# Altium schematic sheet Kasil_DIOT_x86_board.SchDoc
size 420 x 297 mm; SheetNumber: 1; SheetTotal: 11; ModifiedBy: -; CheckedDate: -; Title2: Title 2; DivGrp: WUT ISE; Designer: G.Kasprowicz
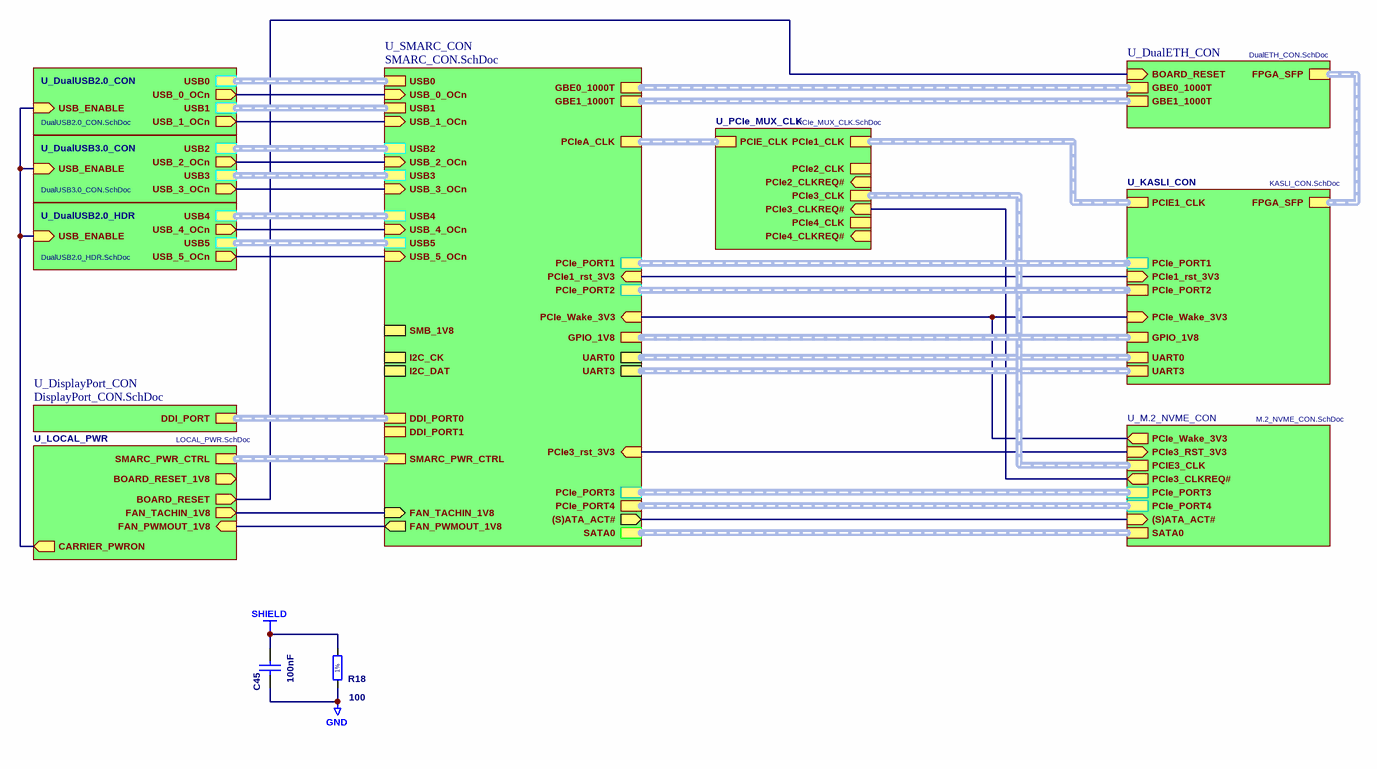
[diagram p0: Kasil_DIOT_x86_board.SchDoc]

## Parts
C45  100nF  [CAPC1005X55N]
R18  100  [RESC1005X40N]

## Sub-sheets
U_DisplayPort_CON = DisplayPort_CON.SchDoc: DDI_PORT (harness DDI_PORT)
U_DualETH_CON = DualETH_CON.SchDoc: GBE0_1000T (harness GBE_copper), GBE1_1000T (harness GBE_copper), FPGA_SFP (harness SFP), BOARD_RESET (in)
U_DualUSB2.0_CON = DualUSB2.0_CON.SchDoc: USB_0_OCn (out), USB1 (harness USB2.0), USB0 (harness USB2.0), USB_1_OCn (out), USB_ENABLE (in)
U_DualUSB2.0_HDR = DualUSB2.0_HDR.SchDoc: USB_5_OCn (out), USB4 (harness USB2.0), USB5 (harness USB2.0), USB_4_OCn (out), USB_ENABLE (in)
U_DualUSB3.0_CON = DualUSB3.0_CON.SchDoc: USB_3_OCn (out), USB3 (harness USB3.0), USB2 (harness USB3.0), USB_2_OCn (out), USB_ENABLE (in)
U_KASLI_CON = KASLI_CON.SchDoc: UART0 (harness UART), UART3 (harness UART), GPIO_1V8 (harness GPIO), PCIE1_CLK (harness CLOCK_DIFF), PCIe_PORT1 (harness PCIe_port), PCIe_PORT2 (harness PCIe_port), FPGA_SFP (harness SFP), PCIe1_rst_3V3 (in), PCIe_Wake_3V3 (in)
U_LOCAL_PWR = LOCAL_PWR.SchDoc: SMARC_PWR_CTRL (harness SMARC_PWR_CTRL), BOARD_RESET (out), BOARD_RESET_1V8 (out), FAN_TACHIN_1V8 (out), FAN_PWMOUT_1V8 (in), CARRIER_PWRON (out)
U_M.2_NVME_CON = M.2_NVME_CON.SchDoc: PCIe3_RST_3V3 (in), PCIe_PORT3 (harness PCIe_port), PCIE3_CLK (harness CLOCK_DIFF), PCIe_PORT4 (harness PCIe_port), PCIe3_CLKREQ# (out), SATA0 (harness SATA), (S)ATA_ACT# (in), PCIe_Wake_3V3 (out)
U_PCIe_MUX_CLK = PCIe_MUX_CLK.SchDoc: PCIE_CLK (harness CLOCK_DIFF), PCIe1_CLK (harness CLOCK_DIFF), PCIe2_CLK (harness CLOCK_DIFF), PCIe3_CLK (harness CLOCK_DIFF), PCIe4_CLK (harness CLOCK_DIFF), PCIe2_CLKREQ# (in), PCIe3_CLKREQ# (in), PCIe4_CLKREQ# (in)
U_SMARC_CON = SMARC_CON.SchDoc: I2C_CK, I2C_DAT, SMB_1V8 (harness SMB), USB_3_OCn (in), USB_0_OCn (in), USB_5_OCn (in), (S)ATA_ACT# (out), USB4 (harness USB2.0), USB5 (harness USB2.0), USB_1_OCn (in), USB_2_OCn (in), USB_4_OCn (in), UART3 (harness UART), UART0 (harness UART), FAN_TACHIN_1V8 (in), FAN_PWMOUT_1V8 (out), PCIe_PORT1 (harness PCIe_port), PCIe_PORT2 (harness PCIe_port), PCIe_PORT3 (harness PCIe_port), USB3 (harness USB3.0), USB2 (harness USB3.0), GBE0_1000T (harness GBE_copper), SATA0 (harness SATA), DDI_PORT0 (harness DDI_PORT), DDI_PORT1 (harness DDI_PORT), SMARC_PWR_CTRL (harness SMARC_PWR_CTRL), GBE1_1000T (harness GBE_copper), PCIeA_CLK (harness CLOCK_DIFF), PCIe_PORT4 (harness PCIe_port), USB0 (harness USB2.0), USB1 (harness USB2.0), PCIe1_rst_3V3 (in), PCIe_Wake_3V3 (in), PCIe3_rst_3V3 (in), GPIO_1V8 (harness GPIO)

## Nets
GND: C45.1 R18.1
SHIELD: C45.2 R18.2
(unnamed): sheet U_SMARC_CON/USB_3_OCn, sheet U_DualUSB3.0_CON/USB_3_OCn
(unnamed): sheet U_SMARC_CON/USB_0_OCn, sheet U_DualUSB2.0_CON/USB_0_OCn
(unnamed): sheet U_SMARC_CON/USB_5_OCn, sheet U_DualUSB2.0_HDR/USB_5_OCn
(unnamed): sheet U_SMARC_CON/(S)ATA_ACT#, sheet U_M.2_NVME_CON/(S)ATA_ACT#
(unnamed): sheet U_SMARC_CON/USB_1_OCn, sheet U_DualUSB2.0_CON/USB_1_OCn
(unnamed): sheet U_SMARC_CON/USB_2_OCn, sheet U_DualUSB3.0_CON/USB_2_OCn
(unnamed): sheet U_SMARC_CON/USB_4_OCn, sheet U_DualUSB2.0_HDR/USB_4_OCn
(unnamed): sheet U_SMARC_CON/FAN_TACHIN_1V8, sheet U_LOCAL_PWR/FAN_TACHIN_1V8
(unnamed): sheet U_SMARC_CON/FAN_PWMOUT_1V8, sheet U_LOCAL_PWR/FAN_PWMOUT_1V8
(unnamed): sheet U_SMARC_CON/PCIe1_rst_3V3, sheet U_KASLI_CON/PCIe1_rst_3V3
(unnamed): sheet U_SMARC_CON/PCIe_Wake_3V3, sheet U_KASLI_CON/PCIe_Wake_3V3, sheet U_M.2_NVME_CON/PCIe_Wake_3V3
(unnamed): sheet U_SMARC_CON/PCIe3_rst_3V3, sheet U_M.2_NVME_CON/PCIe3_RST_3V3
(unnamed): sheet U_DualETH_CON/BOARD_RESET, sheet U_LOCAL_PWR/BOARD_RESET
(unnamed): sheet U_DualUSB2.0_CON/USB_ENABLE, sheet U_DualUSB3.0_CON/USB_ENABLE, sheet U_LOCAL_PWR/CARRIER_PWRON, sheet U_DualUSB2.0_HDR/USB_ENABLE
(unnamed): sheet U_M.2_NVME_CON/PCIe3_CLKREQ#, sheet U_PCIe_MUX_CLK/PCIe3_CLKREQ#

## Buses and harness runs
harness sheet U_DisplayPort_CON/DDI_PORT = sheet U_SMARC_CON/DDI_PORT0
harness sheet U_DualETH_CON/FPGA_SFP = sheet U_KASLI_CON/FPGA_SFP
harness sheet U_DualETH_CON/GBE0_1000T = sheet U_SMARC_CON/GBE0_1000T
harness sheet U_DualETH_CON/GBE1_1000T = sheet U_SMARC_CON/GBE1_1000T
harness sheet U_DualUSB2.0_CON/USB0 = sheet U_SMARC_CON/USB0
harness sheet U_DualUSB2.0_CON/USB1 = sheet U_SMARC_CON/USB1
harness sheet U_DualUSB2.0_HDR/USB4 = sheet U_SMARC_CON/USB4
harness sheet U_DualUSB2.0_HDR/USB5 = sheet U_SMARC_CON/USB5
harness sheet U_DualUSB3.0_CON/USB2 = sheet U_SMARC_CON/USB2
harness sheet U_DualUSB3.0_CON/USB3 = sheet U_SMARC_CON/USB3
harness sheet U_KASLI_CON/GPIO_1V8 = sheet U_SMARC_CON/GPIO_1V8
harness sheet U_KASLI_CON/PCIE1_CLK = sheet U_PCIe_MUX_CLK/PCIe1_CLK
harness sheet U_KASLI_CON/PCIe_PORT1 = sheet U_SMARC_CON/PCIe_PORT1
harness sheet U_KASLI_CON/PCIe_PORT2 = sheet U_SMARC_CON/PCIe_PORT2
harness sheet U_KASLI_CON/UART0 = sheet U_SMARC_CON/UART0
harness sheet U_KASLI_CON/UART3 = sheet U_SMARC_CON/UART3
harness sheet U_LOCAL_PWR/SMARC_PWR_CTRL = sheet U_SMARC_CON/SMARC_PWR_CTRL
harness sheet U_M.2_NVME_CON/PCIE3_CLK = sheet U_PCIe_MUX_CLK/PCIe3_CLK
harness sheet U_M.2_NVME_CON/PCIe_PORT3 = sheet U_SMARC_CON/PCIe_PORT3
harness sheet U_M.2_NVME_CON/PCIe_PORT4 = sheet U_SMARC_CON/PCIe_PORT4
harness sheet U_M.2_NVME_CON/SATA0 = sheet U_SMARC_CON/SATA0
harness sheet U_PCIe_MUX_CLK/PCIE_CLK = sheet U_SMARC_CON/PCIeA_CLK

## Notes on the sheet
- Project/Equipment
- Document
- Designer
- Drawn by
- Check.by
- Copyright WUT ISE 2024.
  This documentation describes Open Hardware and is licensed under the CERN OHL v.2. You may redistribute and modify this documentation under the terms of the CERN OHL v.2. (http://ohwr.org/CERNOHL). This documentation is distributed WITHOUT ANY EXPRESS OR IMPLIED WARRANTY, INCLUDING OF MERCHANTABILITY, SATISFACTORY QUALITY AND FITNESS FOR A PARTICULAR PURPOSE. Please see the CERN OHL v.2 for applicable conditions.
- Contact
- File
- Last Mod.
- Print Date
- Sheet
- Size
- A3
- of
- Rev
- (in symbol R0402_100R_1%_0.0625W_100PPM) 1%

## Library data of the parts
C45 = CC0402_100NF_16V_10%_X7R: Non-polarised capacitor; Part Description: SMD Multilayer Chip Ceramic Capacitor; Manufacturer: GENERIC; Manufacturer1 Part Number: GRM155R71C104KA88D; Voltage: 16V; TC: X7R; Tolerance: ±10%; Part Number: CC0402_100NF_16V_10%_X7R; Component Kind: Standard; Component Type: Standard; Pin Count: 2; Value: 100nF; Status: Not Recommended; Manufacturer Part Number: CC0402_100NF_16V_10%_X7R; Case: 0402; Mounted: Yes; Socket: No; SMD: Yes; Sense: No; Manufacturer1 Example: MURATA; Manufacturer1 ComponentHeight: 0.55mm; HelpURL: \\cern.ch\dfs\Applications\Altium\Datasheets\CC0402_X7R_MURATA_GRM.pdf; Author: CERN DEM JLC; CreateDate: 05/12/2013; LatestRevisionDate: 03/12/2007
R18 = R0402_100R_1%_0.0625W_100PPM: Resistor - 1%; Part Description: General Purpose Thick Film Chip Resistor; Manufacturer: GENERIC; Manufacturer1 Part Number: 232270671001L; TC: ±100ppm/°C; Table: Resistors SMD; Part Number: R0402_100R_1%_0.0625W_100PPM; Component Kind: Standard; Component Type: Standard; Pin Count: 2; Value: 100; Status: Not recommended; Power: 0.0625W; Tolerance: ±1%; Manufacturer Part Number: R0402_100R_1%_0.0625W_100PPM; Case: 0402; Mounted: Yes; Socket: No; SMD: Yes; Manufacturer1 Example: YAGEO PHYCOMP; Manufacturer1 ComponentHeight: 0.4mm; HelpURL: \\cern.ch\dfs\Applications\Altium\Datasheets\R0402_Phycomp_RC0402.pdf; Author: CERN DEM JLC; CreateDate: 2007-12-03; LatestRevisionDate: 2012-10-17